# Altium schematic sheet STM32F103 DEBUGGER.SchDoc: DEBUGERR
size A4; Date: *******; ApprovedBy: *******; CheckedBy: None; Author: *******; CompanyName: *******; DrawnBy: Name; Engineer: *******; Organization: *******; Address1: *******; Address2: *******; Address3: *******; Address4: *******; DocumentNumber: 4; Revision: *******; SheetNumber: 4; SheetTotal: 11; CurrentTime: *******; CurrentDate: *******; Time: *******; DocumentFullPathAndName: *******; DocumentName: *******; ModifiedDate: *******; ImagePath: *******; ProjectName: *******; Application_BuildNumber: *******
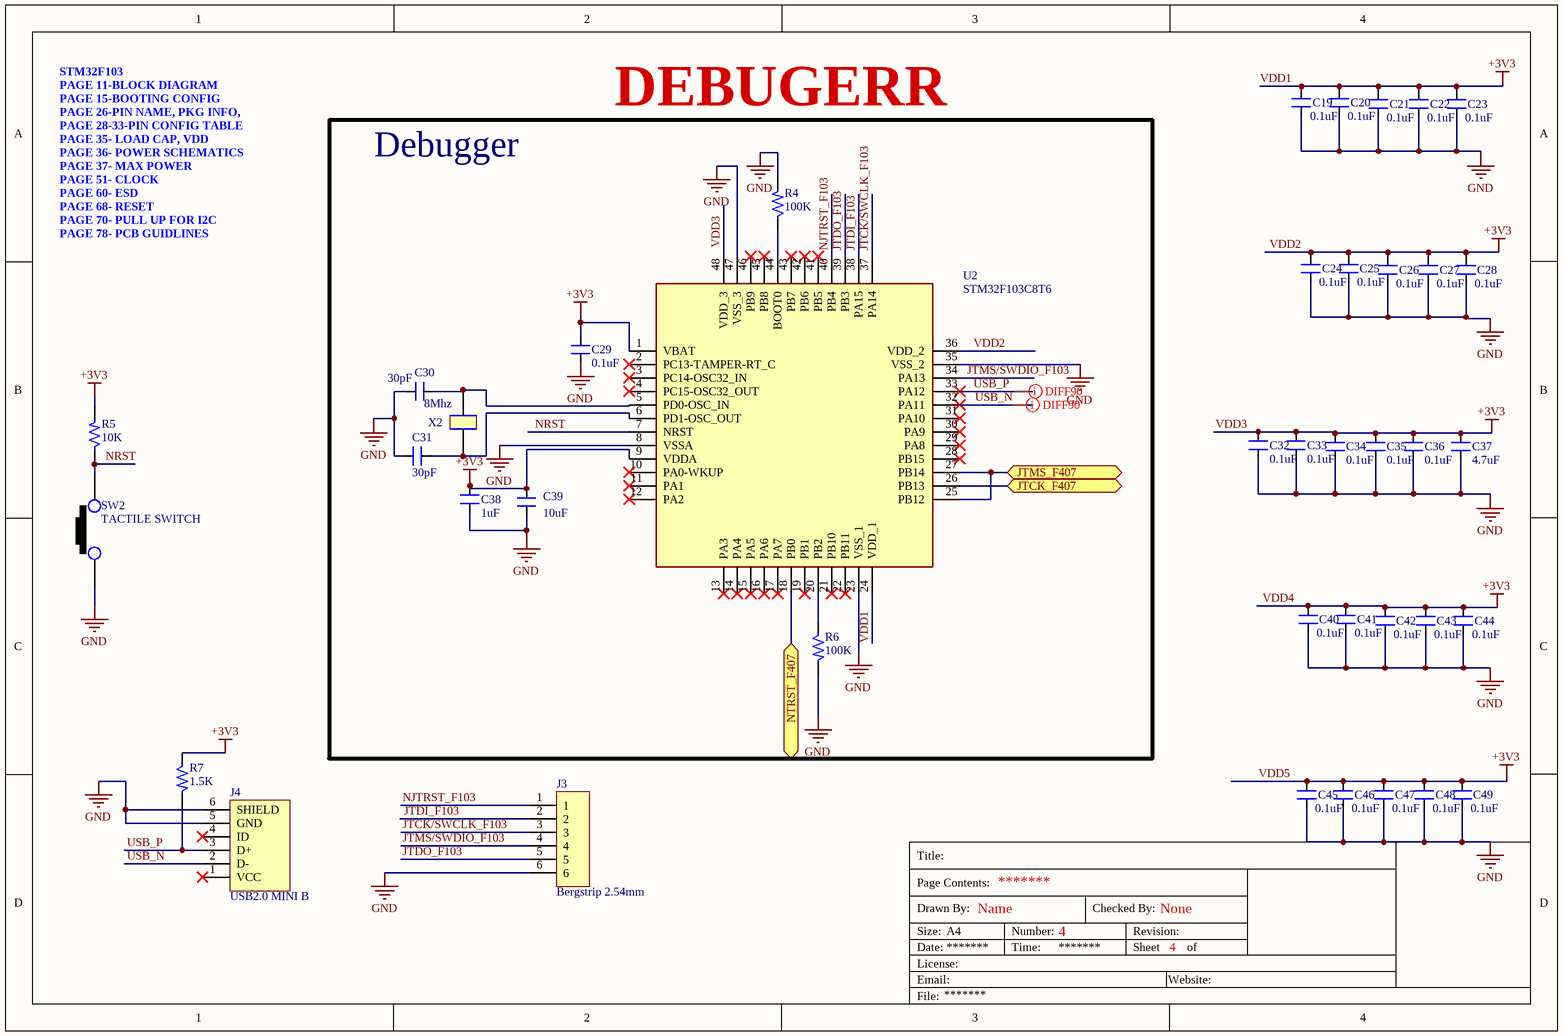
[diagram p0: STM32F103 DEBUGGER.SchDoc]

## Parts
C19  0.1uF  [CAP_1206]
C20  0.1uF  [CAP_1206]
C21  0.1uF  [CAP_1206]
C22  0.1uF  [CAP_1206]
C23  0.1uF  [CAP_1206]
C24  0.1uF  [CAP_1206]
C25  0.1uF  [CAP_1206]
C26  0.1uF  [CAP_1206]
C27  0.1uF  [CAP_1206]
C28  0.1uF  [CAP_1206]
C29  0.1uF  [CAP_0805]
C30  30pF  [CAP_0805]
C31  30pF  [CAP_0805]
C32  0.1uF  [CAP_1206]
C33  0.1uF  [CAP_1206]
C34  0.1uF  [CAP_1206]
C35  0.1uF  [CAP_1206]
C36  0.1uF  [CAP_1206]
C37  4.7uF  [CAP_0805]
C38  1uF  [CAP_0805]
C39  10uF  [CAP_1206]
C40  0.1uF  [CAP_1206]
C41  0.1uF  [CAP_1206]
C42  0.1uF  [CAP_1206]
C43  0.1uF  [CAP_1206]
C44  0.1uF  [CAP_1206]
C45  0.1uF  [CAP_1206]
C46  0.1uF  [CAP_1206]
C47  0.1uF  [CAP_1206]
C48  0.1uF  [CAP_1206]
C49  0.1uF  [CAP_1206]
J3  Bergstrip 2.54mm  [CON6_100_59D78_TH_ST]
J4  USB2.0 MINI B  [CON_690-005-299-043]
R4  100K  [RES_0603]
R5  10K  [RES_0603]
R6  100K  [RES_0603]
R7  1.5K  [RES_0805]
SW2  TACTILE SWITCH  [SW_342_SMD]
U2  STM32F103C8T6  [LQFP-48_19.6_393_58X11_SMD]
X2  8Mhz  [XTAL_314_240X47_SMD]

## Blocks framed on the sheet
Debugger: C29-C31 C38 C39 R4 R6 U2 X2

## Ports
JTCK_F407 (bidir), JTMS_F407 (bidir), NTRST_F407 (bidir)

## Nets
GND: C19.1 C20.1 C21.1 C22.1 C23.1 C24.1 C25.1 C26.1 C27.1 C28.1 C29.1 C30.1 C31.1 C32.1 C33.1 C34.1 C35.1 C36.1 C37.1 C38.1 C39.1 C40.1 C41.1 C42.1 C43.1 C44.1 C45.1 C46.1 C47.1 C48.1 C49.1 J3.6 J4.5(GND) J4.6(SHIELD) R4.2 R6.2 SW2.1 U2.8(VSSA) U2.23(VSS_1) U2.35(VSS_2) U2.47(VSS_3)
VDD1: C19.2 C20.2 C21.2 C22.2 C23.2 C24.2 C25.2 C26.2 C27.2 C28.2 C29.2 C32.2 C33.2 C34.2 C35.2 C36.2 C37.2 C38.2 C39.2 C40.2 C41.2 C42.2 C43.2 C44.2 C45.2 C46.2 C47.2 C48.2 C49.2 R5.2 R7.1 U2.1(VBAT) U2.9(VDDA) U2.24(VDD_1) U2.36(VDD_2) U2.48(VDD_3)  [also labelled +3V3, VDD2, VDD3, VDD4, VDD5]
JTCK/SWCLK_F103: J3.3 U2.37(PA14)
JTCK_F407: U2.26(PB13) ; port JTCK_F407
JTDI_F103: J3.2 U2.38(PA15)
JTDO_F103: J3.5 U2.39(PB3)
JTMS/SWDIO_F103: J3.4 U2.34(PA13)
JTMS_F407: U2.25(PB12) U2.27(PB14) ; port JTMS_F407
NJTRST_F103: J3.1 U2.40(PB4)
NRST: R5.1 SW2.2 U2.7(NRST)
NTRST_F407: U2.18(PB0) ; port NTRST_F407
USB_N: J4.2(D-) U2.32(PA11)
USB_P: J4.3(D+) R7.2 U2.33(PA12)
NetC30_2: C30.2 U2.5(PD0-OSC_IN) X2.2
NetC31_2: C31.2 U2.6(PD1-OSC_OUT) X2.1
NetR4_1: R4.1 U2.44(BOOT0)
NetR6_1: R6.1 U2.20(PB2)

Not connected (* = marked no-connect by the designer): J4 1(VCC)* 4(ID)*; U2 2(PC13-TAMPER-RT_C)* 3(PC14-OSC32_IN)* 4(PC15-OSC32_OUT)* 10(PA0-WKUP)* 11(PA1)* 12(PA2)* 13(PA3)* 14(PA4)* 15(PA5)* 16(PA6)* 17(PA7)* 19(PB1)* 21(PB10)* 22(PB11)* 28(PB15)* 29(PA8)* 30(PA9)* 31(PA10)* 41(PB5)* 42(PB6)* 43(PB7)* 45(PB8)* 46(PB9)*

## Layout directives
differential pair; differential pair class DIFF90: USB_N, USB_P

## Notes on the sheet
- STM32F103
  PAGE 11-BLOCK DIAGRAM
  PAGE 15-BOOTING CONFIG
  PAGE 26-PIN NAME, PKG INFO,
  PAGE 28-33-PIN CONFIG TABLE
  PAGE 35- LOAD CAP, VDD
  PAGE 36- POWER SCHEMATICS
  PAGE 37- MAX POWER
  PAGE 51- CLOCK
  PAGE 60- ESD
  PAGE 68- RESET
  PAGE 70- PULL UP FOR I2C
  PAGE 78- PCB GUIDLINES
- Title:
- Drawn By:
- Page Contents:
- Checked By:
- Size:
- Date:
- File:
- License:
- Email:
- A4
- Number:
- Time:
- Revision:
- Sheet
- Website:
- of

## Library data of the parts
C19-C28 C32-C36 C40-C49 = CAP_0.1uF-50V-5%-1206: 0.1µF ±5% 50V Ceramic Capacitor X7R 1206 (3216 Metric); Manufacturer: KEMET; Manufacturer Part Number: C1206C104J5RACTU; Alternate Part Number-1: NA; Case/Package: 1206; Supplier-1: SIRICOM; Supplier Part Number-1: 1206B104J500CT
C29 = CAP_0.1uF-50V-10%-0805: 0.1µF ±10% 50V Ceramic Capacitor X7R 0805 (2012 Metric); Manufacturer: Samsung; Manufacturer Part Number: CL21B104KBCNNNC; Alternate Part Number-1: NA; Case/Package: 0805; Supplier-1: SIRICOM; Supplier Part Number-1: 0805B104K500CT
C30 C31 = CAP_30pF-50V-10%-0805: ±10% 50V Ceramic Capacitor C0G, NP0 0805 (2012 Metric); Manufacturer Part Number: C0805C300K5GAC7800; Manufacturer: KEMET; Alternate Part Number: NA; Case/Package: 0805; Supplier-1: Digikey; Supplier Part Number-1: 399-17443-1-ND - Cut Tape (CT)
C37 = CAP_4.7uF-50V-10%-0805: 4.7µF ±10% 50V Ceramic Capacitor X5R 0805 (2012 Metric); Manufacturer: Yageo; Manufacturer Part Number: GRM21BR61H475KE51L; Alternate Part Number-1: NA; Case/Package: 0805; Supplier-1: SIRICOM; Supplier Part Number-1: CL21A475KBQNNNE
C38 = CAP_1uF-50V-5%-0805: 1µF ±5% 50V Ceramic Capacitor X7R 0805 (2012 Metric); Manufacturer: Samsung; Manufacturer Part Number: CC0805JKX7R9BB105; Alternate Part Number-1: 0805F105M500NT; Case/Package: 0805; Supplier-1: SIRICOM; Supplier Part Number-1: CL21B105KBFNNNE
C39 = CAP_10uF-50V-10%-1206: 10µF ±10% 50V Ceramic Capacitor X7R 1206 (3216 Metric); Manufacturer: KEMET; Manufacturer Part Number: CL31B106KBHNNNE; Alternate Part Number-1: GRT31CR61H106ME01L; Case/Package: 1206; Supplier-1: SIRICOM; Supplier Part Number-1: CC1206KKX5R9BB106
J3 = CON-BS-SKT_6X1-100-ST-TH: 6 Pins, 1 Row 2.54mm Pitch, Straight bergstrip, Female; Manufacturer: Molex; Alternate Part Number-1: NA; Manufacturer Part Number: 22-10-2061; Case/Package: TH-CON; Supplier-1: SP ROAD; Supplier Part Number-1: NA
J4 = CON_USB2.0-MINIB-SMD: USB - mini B USB 2.0 Receptacle Connector 5 Position Surface Mount, Right Angle; Manufacturer: EDAC; Manufacturer Part Number: 690-005-299-043; Alternate Part Number-1: NA; Case/Package: USB-MINI-B; Supplier-1: LCSC; Supplier Part Number-1: C105424
R4 R6 = RES_100K-0.1W-1%-0603: 100 kOhms ±1% 0.1W, 1/10W Chip Resistor 0603 (1608 Metric) Automotive AEC-Q200 Thick Film; Manufacturer: Stackpole Electronics; Manufacturer Part Number: RMCF0603FT100K; Alternate Part Number-1: NA; Case/Package: 0603; Supplier-1: Arrow; Supplier Part Number-1: RMCF0603FT100K
R5 = RES_10K-0.1W-1%-0603: 10 kOhms ±1% 0.1W, 1/10W Chip Resistor 0603 (1608 Metric) Automotive AEC-Q200 Thick Film; Manufacturer: Walsin; Manufacturer Part Number: WR06X1002FTL; Alternate Part Number-1: 0603WAJ0103T5E; Case/Package: 0603; Supplier-1: SIRICOM; Supplier Part Number-1: WR06X1002FTL
R7 = RES_1.5K-0.125W-1%-0805: 1.5 kOhms ±1% 0.125W, 1/8W Chip Resistor 0805 (2012 Metric) Thick Film; Manufacturer: TE Connectivity Passive Product; Manufacturer Part Number: CRG0805F1K5; Alternate Part Number-1: NA; Case/Package: 0805; Supplier-1: SIRICOM; Supplier Part Number-1: NA
SW2 = SW1_RS-282G05A3-SMRT-SMD: Tactile Switch SPST-NO Top Actuated Surface Mount; Manufacturer: ITT C&K; Alternate Part Number-1: NA; Manufacturer Part Number: RS-282G05A3-SMRT; Case/Package: SMD; Supplier-1: SP ROAD; Supplier Part Number-1: RS-282G05A3-SMRT
U2 = IC_STM32F103C8T6: ARM® Cortex®-M3 STM32F1 Microcontroller IC 32-Bit 72MHz 64KB (64K x 8) FLASH 48-LQFP (7x7); Manufacturer: STMicroelectronics; Alternate Part Number-1: NA; Manufacturer Part Number: STM32F103C8T6; Case/Package: LQFP48; Supplier-1: LCSC; Supplier Part Number-1: STM32F103C8T6
X2 = XTAL_8MHZ-ECS-80-32-5PX-SMD: 8MHz ±30ppm Crystal 32pF 60 Ohms HC-49/US; Manufacturer: Fox Electronics; Manufacturer Part Number: ECS-80-32-5PX-TR; Alternate Part Number-1: NA; Case/Package: SMD/SMT; Supplier-1: SP ROAD; Supplier Part Number-1: ECS-80-32-5PX-TR